# Altium schematic sheet bottom_sheet.schdoc
size 297 x 213 mm
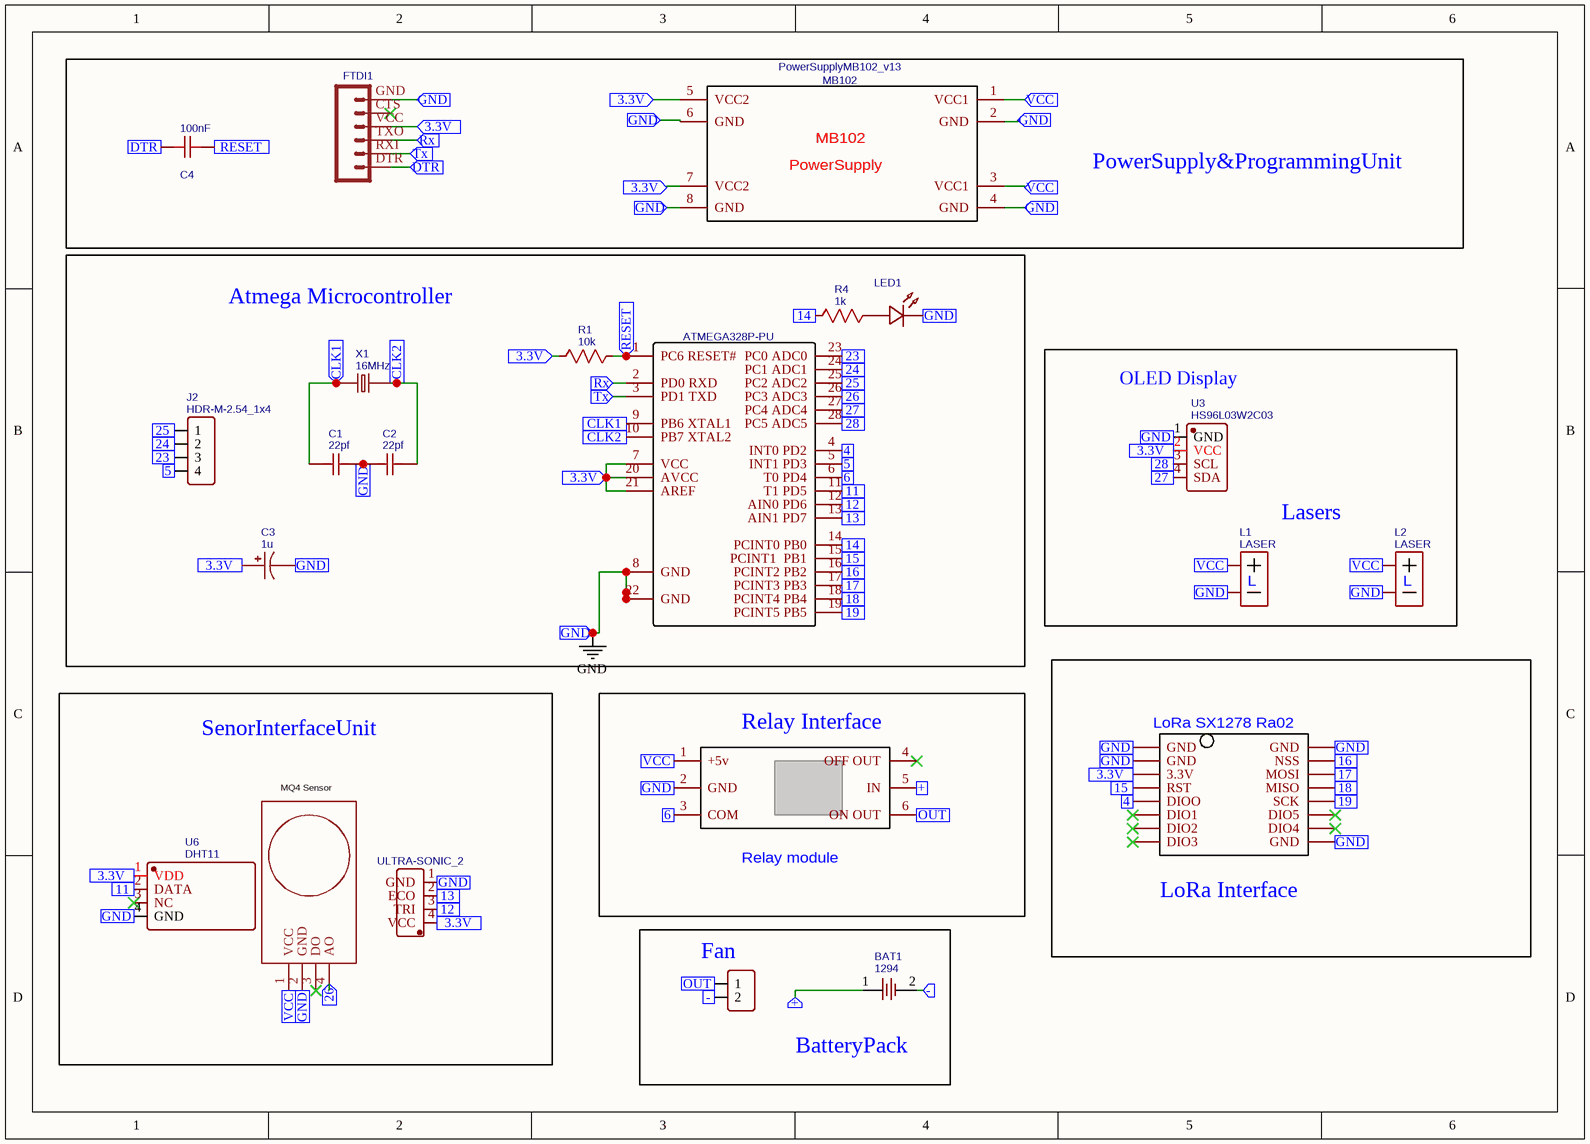
[diagram p0: bottom_sheet.schdoc]

## Parts
BAT1  1294  [BAT-TH_BH-1294_1]
C1  22pf  [RAD-0.1]
C2  22pf  [RAD-0.1]
C3  1u  [CAP-D3.0×F1.5]
C4  100nF  [RAD-0.1]
CN1  ULTRASONIC-HC-SR04  [ULTRASONIC-HC-SR04]  (value not drawn)
FTDI1  FTDI_BASIC  [FTDI_BASIC]  (value not drawn)
J2  HDR-M-2.54_1x4  [HDR-M-2.54_1X4]
L1  LASER  [LASER]
L2  LASER  [LASER]
LED1  LED-TH-3mm_R  [LED-TH_BD3.0_RED]  (value not drawn)
P1  CONN-TH_2P-P5.00  [CONN-TH_2P-P5.00]  (value not drawn)
R1  10k  [R_AXIAL-0.3]
R4  1k  [R_AXIAL-0.3]
U1  ATMEGA328P-PU  [DIP-28_L34.6-W7.3-P2.54-LS10.2-BL]
U2  mb102 47,2  [POWERSUPPLYMB102 47,2]  (value not drawn)
U3  HS96L03W2C03  [OLED-TH_L27.8-W27.2-P2.54_C9900033791]
U4  Relay module for Arduino  [ARDUINO RELAY 5V MODULE 1CH]  (value not drawn)
U5  LoRa Ra-02  Module  [LORA RA02 SX1278 VINODREDDY]  (value not drawn)
U6  DHT11  [SENSOR-TH_DHT11]
U7  GAS-SENSOR-MQ2  [GAS-SENSOR-MQ2]  (value not drawn)
X1  16MHz  [HC-49US_L11.5-W4.5-P4.88]

## Blocks framed on the sheet
PowerSupply&ProgrammingUnit: C4 FTDI1 U2
Atmega Microcontroller: C1-C3 J2 LED1 R1 R4 U1 X1
Lasers: L1 L2 U3
LoRa Interface: U5
SenorInterfaceUnit: CN1 U6 U7
Relay Interface: U4

## Ports
3.3V (in), 4 (in), 5 (in), 6 (in), 11 (in), 12 (in), 13 (in), 14 (in), 15 (in), 16 (in), 17 (in), 18 (in), 19 (in), 23 (in), 24 (in), 25 (in), 26 (in), 27 (in), 28 (in), + (in), - (in), CLK1 (in), CLK2 (in), DTR (in), GND (in), OUT (in), RESET (in), Rx (in), Tx (in), VCC (in)

## Nets
GND: C1.2 C2.1 C3.2 CN1.1(GND) FTDI1.GND L1.2 L2.2 LED1.2 U1.8(GND) U1.22(GND) U2.2(GND) U2.4(GND) U2.6(GND) U2.8(GND) U3.1(GND) U4.2(GND) U5.1(GND) U5.2(GND) U5.9(GND) U5.16(GND) U6.4(GND) U7.2(GND) ; port GND
3.3V: C3.1 CN1.4(VCC) FTDI1.VCC R1.1 U1.7(VCC) U1.20(AVCC) U1.21(AREF) U2.5(VCC2) U2.7(VCC2) U3.2(VCC) U5.3(3.3V) U6.1(VDD) ; port 3.3V
4: U1.4(INT0_PD2) U5.5(DIOO) ; port 4
5: J2.4 U1.5(INT1_PD3) ; port 5
6: U1.6(T0_PD4) U4.3(COM) ; port 6
11: U1.11(T1_PD5) U6.2(DATA) ; port 11
12: CN1.3(TRI) U1.12(AIN0_PD6) ; port 12
13: CN1.2(ECO) U1.13(AIN1_PD7) ; port 13
14: R4.1 U1.14(PCINT0_PB0) ; port 14
15: U1.15(PCINT1__PB1) U5.4(RST) ; port 15
16: U1.16(PCINT2_PB2) U5.15(NSS) ; port 16
17: U1.17(PCINT3_PB3) U5.14(MOSI) ; port 17
18: U1.18(PCINT4_PB4) U5.13(MISO) ; port 18
19: U1.19(PCINT5_PB5) U5.12(SCK) ; port 19
23: J2.3 U1.23(PC0_ADC0) ; port 23
24: J2.2 U1.24(PC1_ADC1) ; port 24
25: J2.1 U1.25(PC2_ADC2) ; port 25
26: U1.26(PC3_ADC3) U7.4(AO) ; port 26
27: U1.27(PC4_ADC4) U3.4(SDA) ; port 27
28: U1.28(PC5_ADC5) U3.3(SCL) ; port 28
+: BAT1.1 U4.5(IN) ; port +
-: BAT1.2 P1.2 ; port -
CLK1: C1.1 U1.9(PB6_XTAL1) X1.1 ; port CLK1
CLK2: C2.2 U1.10(PB7_XTAL2) X1.2 ; port CLK2
DTR: C4.1 FTDI1.DTR ; port DTR
OUT: P1.1 U4.6(ON_OUT) ; port OUT
RESET: C4.2 R1.2 U1.1(PC6_RESET#) ; port RESET
Rx: FTDI1.TXO U1.2(PD0_RXD) ; port Rx
Tx: FTDI1.RXI U1.3(PD1_TXD) ; port Tx
VCC: L1.1 L2.1 U2.1(VCC1) U2.3(VCC1) U4.1(+5v) U7.1(VCC) ; port VCC
NetLED1_1: LED1.1 R4.2

Not connected (* = marked no-connect by the designer): FTDI1 CTS(5)*; U4 4(OFF_OUT)*; U5 6(DIO1)* 7(DIO2)* 8(DIO3)* 10(DIO4)* 11(DIO5)*; U6 3(NC)*; U7 3(DO)*

## Notes on the sheet
- (near U3) OLED Display
- (near P1) Fan
- (near BAT1) BatteryPack
- (in symbol GAS-SENSOR-MQ2) MQ4 Sensor
- (in symbol LoRa Ra-02  Module) LoRa SX1278 Ra02
- (in symbol mb102 47,2) PowerSupplyMB102_v13; MB102; PowerSupply
- (in symbol Relay module for Arduino) Relay module
- (in symbol ULTRASONIC-HC-SR04) ULTRA-SONIC_2

## Library data of the parts
BAT1 = 1294: Manufacturer: Keystone; Contributor: lcsc; Supplier: LCSC; Supplier Part: C5479676; Manufacturer Part: 1294; JLCPCB Part Class: Extended Part; spicePre: B; spiceSymbolName: 1294
C1 C2 = 22pf: nameAlias: Value(F); Contributor: LCEDA_Lib; spicePre: C; spiceSymbolName: C_RAD-0.1_US
C3 = 1u: nameAlias: Value(F); Contributor: LCEDA_Lib; spicePre: C; spiceSymbolName: CE_TH_D3.0×F1.5_US
C4 = 100nF: nameAlias: Value(F); Contributor: LCEDA_Lib; spicePre: C; spiceSymbolName: C_RAD-0.1_US
CN1 = ULTRASONIC-HC-SR04: Manufacturer: kinghelm(金航标); Manufacturer Part: KH-CL0.5-H2.0-4PIN; Contributor: 22f2000814; Supplier: LCSC; Supplier Part: C2797192; JLCPCB Part Class: Extended Part; spicePre: C; spiceSymbolName: ULTRASONIC-HC-SR04
FTDI1 = FTDI_BASIC: Contributor: SparkFun; spicePre: J; spiceSymbolName: FTDI_BASIC
J2 = HDR-M-2.54_1x4: Contributor: LCEDA_Lib; Supplier Part: C124378; Supplier: LCSC; spicePre: J; spiceSymbolName: HDR-M-2.54_1x4
L1 L2 = LASER: Manufacturer Part: Key; Contributor: Vladyslav1989; spicePre: L; spiceSymbolName: LASER
LED1 = LED-TH-3mm_R: Manufacturer: EVERLIGHT(台湾亿光); Manufacturer Part: 204-10SDRD/S530-A3-L; Contributor: LCEDA_Lib; Supplier Part: C84774; Supplier: LCSC; spicePre: L; spiceSymbolName: LED-TH-3mm_R
P1 = CONN-TH_2P-P5.00: Contributor: LCEDA_Lib; Supplier: LCSC; spicePre: P; spiceSymbolName: CONN-TH_2P-P5.00
R1 = 10k: nameAlias: Value(Ω); Contributor: LCEDA_Lib; spicePre: R; spiceSymbolName: R_AXIAL-0.3_US
R4 = 1k: nameAlias: Value(Ω); Contributor: LCEDA_Lib; spicePre: R; spiceSymbolName: R_AXIAL-0.3_US
U1 = ATMEGA328P-PU: Manufacturer: MICROCHIP(美国微芯); sourceId: Oic6oiASL; Contributor: LCSC; timeStamp: 1451725987; Supplier: LCSC; Manufacturer Part: ATMEGA328P-PU; Supplier Part: C33901; JLCPCB Part Class: Extended Part; spicePre: U; spiceSymbolName: ATMEGA328P-PU
U2 = mb102 47,2: Contributor: 22f2000814; spicePre: U; spiceSymbolName: mb102 47,2
U3 = HS96L03W2C03: Manufacturer: HS(汉昇); Contributor: lcsc; Supplier: LCSC; Supplier Part: C5248080; Manufacturer Part: HS96L03W2C03; JLCPCB Part Class: Extended Part; spicePre: U; spiceSymbolName: HS96L03W2C03
U4 = Relay module for Arduino: Contributor: 22f2000814; Manufacturer Part: Relay module for Arduino; link: Tongling JQC-3FF-S-Z; spicePre: U; spiceSymbolName: Relay module for Arduino
U5 = LoRa Ra-02  Module: Contributor: juanmartin1946; spicePre: U; spiceSymbolName: LoRa Ra-02  Module
U6 = DHT11: Manufacturer: 广州奥松; Contributor: LCSC; Supplier: LCSC; Supplier Part: C117051; Manufacturer Part: DHT11; JLCPCB Part Class: Extended Part; spicePre: U; spiceSymbolName: DHT11
U7 = GAS-SENSOR-MQ2: description: Gas Sensor based on MQ-2 device; Contributor: 22f2000814; spicePre: U; spiceSymbolName: GAS-SENSOR-MQ2
X1 = 16MHz: Manufacturer: TAITIEN(泰艺电子); Manufacturer Part: XIHCELNANF-16MHZ; nameAlias: Value; Contributor: LCSC; Supplier: LCSC; Supplier Part: C295075; JLCPCB Part Class: Extended Part; spicePre: X; spiceSymbolName: XIHCELNANF-16MHZ